# Altium schematic sheet S&H.SchDoc
size A4
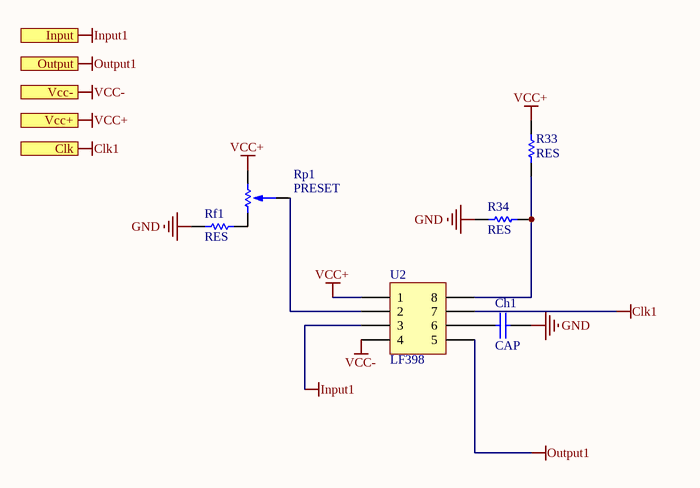
[diagram p0: S&H.SchDoc]

## Parts
Ch1  CAP  [0805]
R33  RES  [0805]
R34  RES  [0805]
Rf1  RES  [0805]
Rp1  PRESET  [PRESET V]
U2  LF398  [DIP8]

## Ports
Clk, Input, Output, Vcc+, Vcc-

## Nets
Clk1: U2.7 ; port Clk
GND: Ch1.2 R34.1 Rf1.1
Input1: U2.3 ; port Input
Output1: U2.5 ; port Output
VCC+: R33.2 Rp1.1 U2.1 ; port Vcc+
VCC-: U2.4 ; port Vcc-
NetCh1_1: Ch1.1 U2.6
NetR33_1: R33.1 R34.2 U2.8
NetRf1_2: Rf1.2 Rp1.3
NetRp1_2: Rp1.2 U2.2

## Library data of the parts
U2 = IC_DIP8